# EAGLE design gripper-rev3 (EAGLE 6.5.0)
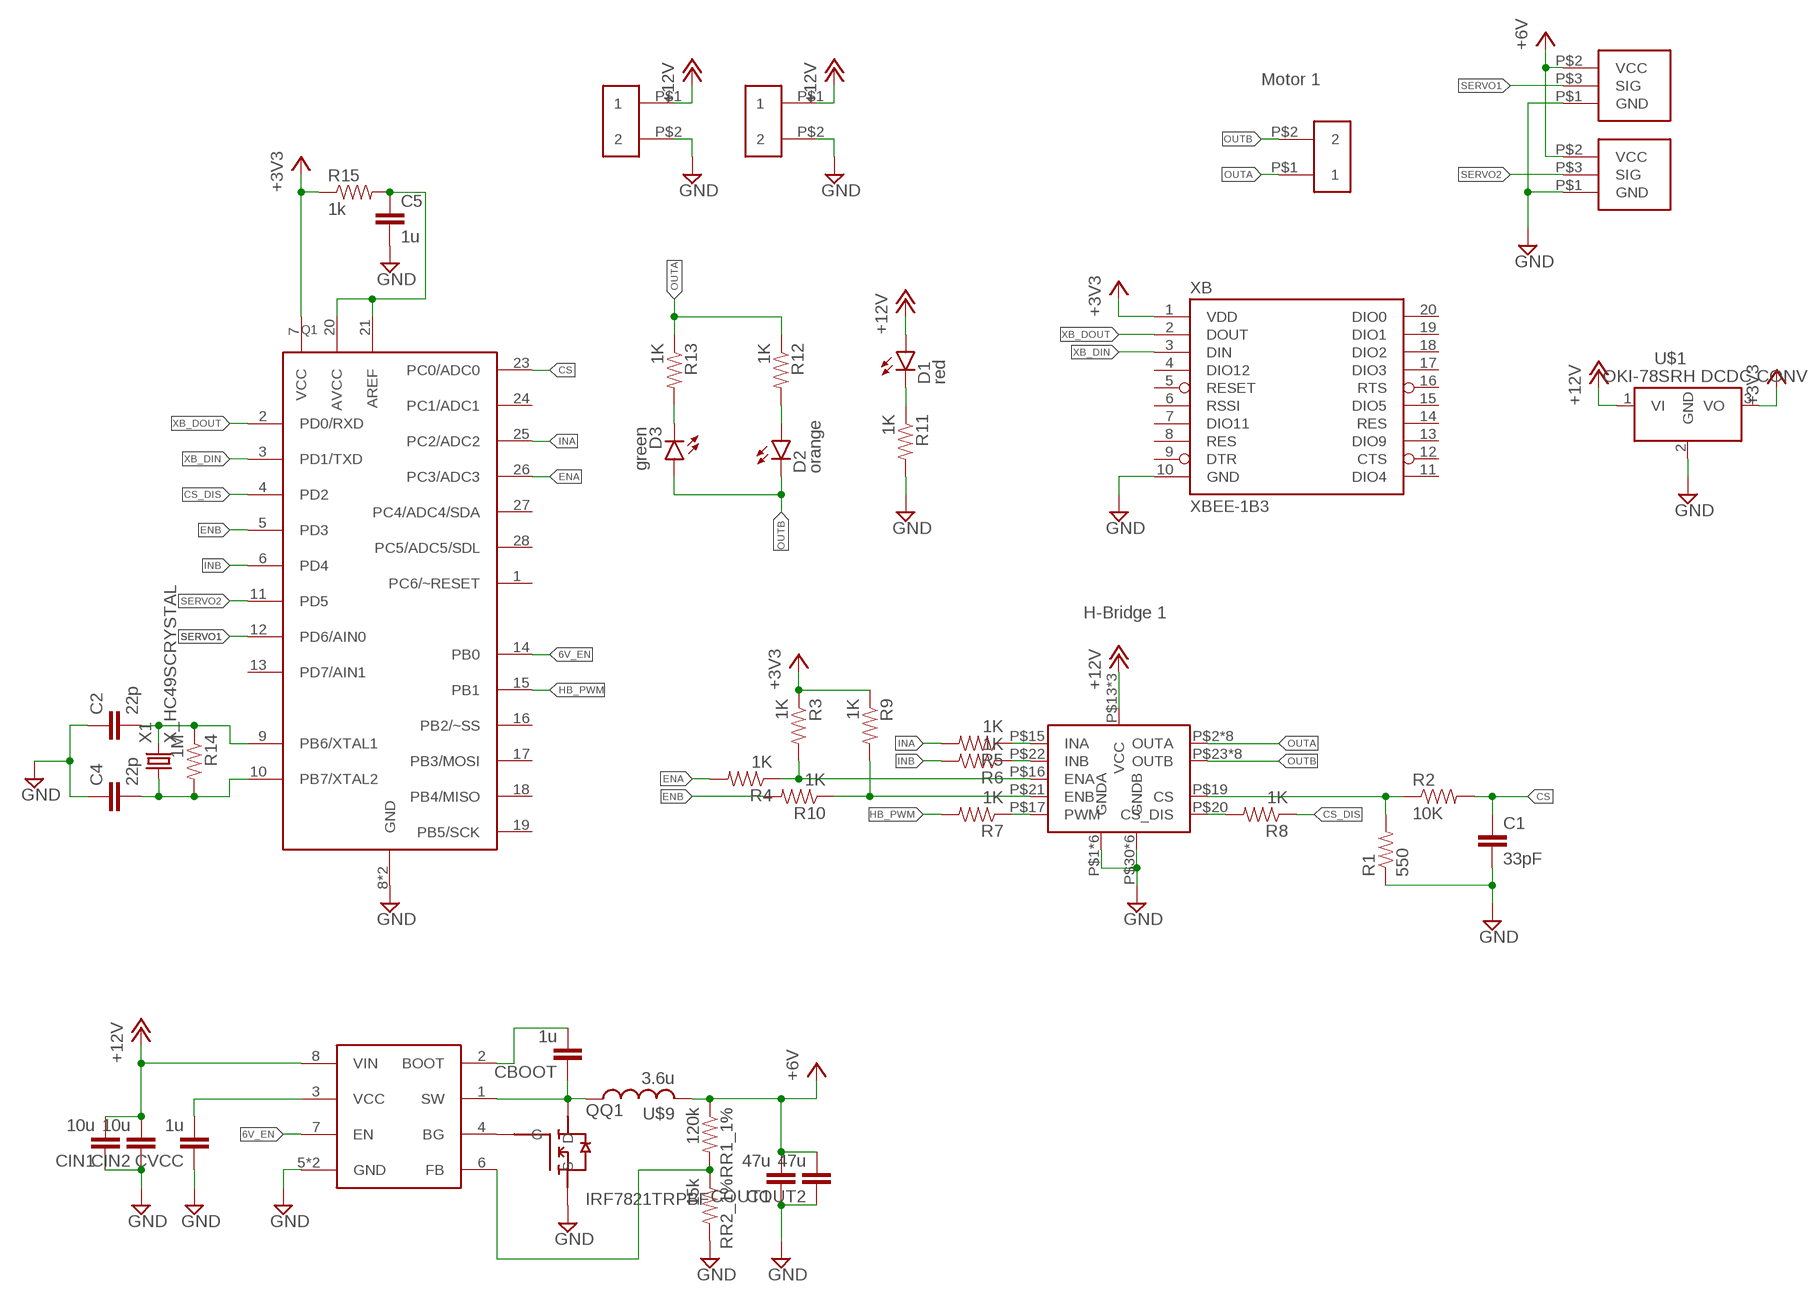
[diagram p0: schematic, sheet 1]

## Parts
C1  33pF  CAP0603-CAP  [0603-CAP]
C2  22p  CAP0603-CAP  [0603-CAP]
C4  22p  CAP0603-CAP  [0603-CAP]
C5  1u  CAP0603-CAP  [0603-CAP]
CBOOT  1u  CAP0603-CAP  [0603-CAP]
CIN1  10u  CAP1206  [1206]
CIN2  10u  CAP1206  [1206]
COUT1  47u  CAP1206  [1206]
COUT2  47u  CAP1206  [1206]
CVCC  1u  CAP0603-CAP  [0603-CAP]
D1  red  LED0603  [LED-0603]
D2  orange  LED0603  [LED-0603]
D3  green  LED0603  [LED-0603]
Q1  Q_ATMEGA328P  [DIP28]
QQ1  IRF7821TRPBF  [SO-08]
R1  550  RESISTOR0603  [0603-RES]
R2  10K  RESISTOR0603  [0603-RES]
R3  1K  RESISTOR0603  [0603-RES]
R4  1K  RESISTOR0603  [0603-RES]
R5  1K  RESISTOR0603  [0603-RES]
R6  1K  RESISTOR0603  [0603-RES]
R7  1K  RESISTOR0603  [0603-RES]
R8  1K  RESISTOR0603  [0603-RES]
R9  1K  RESISTOR0603  [0603-RES]
R10  1K  RESISTOR0603  [0603-RES]
R11  1K  RESISTOR0603  [0603-RES]
R12  1K  RESISTOR0603  [0603-RES]
R13  1K  RESISTOR0603  [0603-RES]
R14  1M  RESISTOR0603  [0603-RES]
R15  1k  RESISTOR0603  [0603-RES]
RR1_1%  120k  RESISTOR0603  [0603-RES]
RR2_1%  15k  RESISTOR0603  [0603-RES]
RT7258  RT7258GSP  [SOP08_W_EP]
U$1  Q_OKI-78SR  [OKI-78SR_HORIZ]
U$2  SERVOHORIZ  [78208-103HLF]
U$3  SERVOHORIZ  [78208-103HLF]
U$4  VNH5XXX_HBRIDGEVNH5050A  [POWERSSO-36_TP]
U$5  M02SCREWTERM_HORIZ  [PC_1935161]
U$6  M02SCREWTERM_HORIZ  [PC_1935161]
U$7  M02SCREWTERM_VERT  [PC_1935310]
U$9  3.6u  NR8040T3R6N  [NR8040T3R6N]
X1  X_HC49SCRYSTAL  [HC-49]
XB  XBEE-1B3  [XBEE-SMD]

## Nets
6V_EN: Q1.14(PB0) RT7258.7(EN)
+3V3: Q1.7(VCC) R3.1 R9.1 R15.1 U$1.3(VO) XB.1(VDD)
+6V: COUT1.2 COUT2.2 RR1_1%.1 U$2.P$2(VCC) U$3.P$2(VCC) U$9.P$2
+12V: CIN1.2 CIN2.2 D1.A RT7258.8(VIN) U$1.1(VI) U$4.P$13(VCC) U$4.P$24(VCC) U$4.SLUG1(VCC) U$5.P$1 U$6.P$1
CS: C1.1 Q1.23(PC0/ADC0) R2.2
CS_DIS: Q1.4(PD2) R8.1
ENA: Q1.26(PC3/ADC3) R4.2
ENB: Q1.5(PD3) R10.2
GND: C1.2 C2.1 C4.1 C5.2 CIN1.1 CIN2.1 COUT1.1 COUT2.1 CVCC.1 Q1.8(GND) Q1.22(GND) QQ1.1(S) QQ1.2(S) QQ1.3(S) R1.1 R11.2 RR2_1%.2 RT7258.5(GND) RT7258.EP(GND) U$1.2(GND) U$2.P$1(GND) U$3.P$1(GND) U$4.P$1(GNDA) U$4.P$3(GNDA) U$4.P$4(GNDA) U$4.P$5(GNDA) U$4.P$6(GNDA) U$4.P$7(GNDA) U$4.P$30(GNDB) U$4.P$31(GNDB) U$4.P$32(GNDB) U$4.P$33(GNDB) U$4.P$34(GNDB) U$4.P$36(GNDB) U$5.P$2 U$6.P$2 XB.10(GND)
HB_PWM: Q1.15(PB1) R7.2
INA: Q1.25(PC2/ADC2) R5.2
INB: Q1.6(PD4) R6.2
N$1: C2.2 Q1.9(PB6/XTAL1) R14.1 X1.P$2
N$2: R5.1 U$4.P$15(INA)
N$3: R1.2 R2.1 U$4.P$19(CS)
N$4: R6.1 U$4.P$22(INB)
N$5: R7.1 U$4.P$17(PWM)
N$6: R3.2 R4.1 U$4.P$16(ENA)
N$7: R9.2 R10.1 U$4.P$21(ENB)
N$8: R8.2 U$4.P$20(CS_DIS)
N$9: D1.C R11.1
N$10: C4.2 Q1.10(PB7/XTAL2) R14.2 X1.P$1
N$11: D2.A R12.2
N$12: D3.C R13.2
N$13: C5.1 Q1.20(AVCC) Q1.21(AREF) R15.2
N$14: CVCC.2 RT7258.3(VCC)
N$15: CBOOT.2 RT7258.2(BOOT)
N$16: RR1_1%.2 RR2_1%.1 RT7258.6(FB)
N$17: QQ1.4(G) RT7258.4(BG)
N$18: CBOOT.1 QQ1.5(D) QQ1.6(D) QQ1.7(D) QQ1.8(D) RT7258.1(SW) U$9.P$1
OUTA: R12.1 R13.1 U$4.P$2(OUTA) U$4.P$8(OUTA) U$4.P$9(OUTA) U$4.P$10(OUTA) U$4.P$11(OUTA) U$4.P$12(OUTA) U$4.P$14(OUTA) U$4.SLUG2(OUTA) U$7.P$1
OUTB: D2.C D3.A U$4.P$23(OUTB) U$4.P$25(OUTB) U$4.P$26(OUTB) U$4.P$27(OUTB) U$4.P$28(OUTB) U$4.P$29(OUTB) U$4.P$35(OUTB) U$4.SLUG3(OUTB) U$7.P$2
SERVO1: Q1.12(PD6/AIN0) U$2.P$3(SIG)
SERVO2: Q1.11(PD5) U$3.P$3(SIG)
XB_DIN: Q1.3(PD1/TXD) XB.3(DIN)
XB_DOUT: Q1.2(PD0/RXD) XB.2(DOUT)
Unconnected: Q1.1(PC6/~RESET) Q1.13(PD7/AIN1) Q1.16(PB2/~SS) Q1.17(PB3/MOSI) Q1.18(PB4/MISO) Q1.19(PB5/SCK) Q1.24(PC1/ADC1) Q1.27(PC4/ADC4/SDA) Q1.28(PC5/ADC5/SDL) XB.4(DIO12) XB.5(RESET) XB.6(RSSI) XB.7(DIO11) XB.8(RES) XB.9(DTR) XB.11(DIO4) XB.12(CTS) XB.13(DIO9) XB.14(RES) XB.15(DIO5) XB.16(RTS) XB.17(DIO3) XB.18(DIO2) XB.19(DIO1) XB.20(DIO0)

## Notes on the sheet
- Motor 1
- H-Bridge 1

## Library data of the parts
C1 C2 C4 C5 CBOOT CVCC = SparkFun-Passives:CAP: Capacitor Standard 0603 ceramic capacitor, and 0.1" leaded capacitor.
CIN1 CIN2 COUT1 COUT2 = SparkFun-Capacitors:CAP: Capacitor Standard 0603 ceramic capacitor, and 0.1" leaded capacitor.
D1-D3 = SparkFun-LED:LED: LEDs Standard schematic elements and footprints for 5mm, 3mm, 1206, and 0603 sized LEDs. 5mm - Spark Fun Electronics SKU : COM-00529 (and others)
Q1 = MRDT-2014-All:Q_ATMEGA328P: ATMEGA 328P in 28PIN PDIP package
QQ1 = MRDT-PowerICs:IRF7821TRPBF
R1-R15 RR1_1% RR2_1% = SparkFun-Resistors:RESISTOR: Resistor Basic schematic elements and footprints for 0603, 1206, and PTH resistors.
RT7258 = MRDT-PowerICs:RT7258GSP
U$1 = MRDT-2015-PowerBoard:Q_OKI-78SR: 4.95W DC/DC Converter Manufacturer: Murata Part Number: OKI-78SR-5/1.5-W36H-C OKI-78SR-3.3/1.5-W36H-C
U$2 U$3 = MRDT-2015-General:SERVO
U$4 = MRDT-PowerICs:VNH5XXX_HBRIDGE
U$5-U$7 = MRDT-Connectors:M02
U$9 = MRDT-Passives:NR8040T3R6N
X1 = MRDT-2014-All:X_HC49SCRYSTAL: CRYSTAL METAL CAN, 16MHZ, 18PF, HC-49/US
XB = SparkFun:XBEE-1

## Board
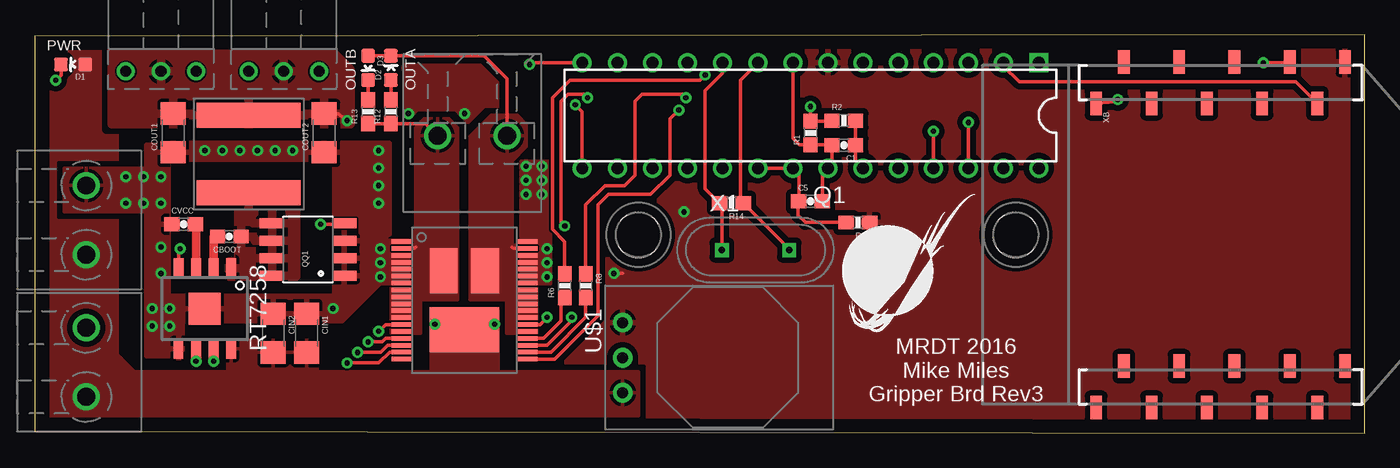
[diagram p1: board, top side]
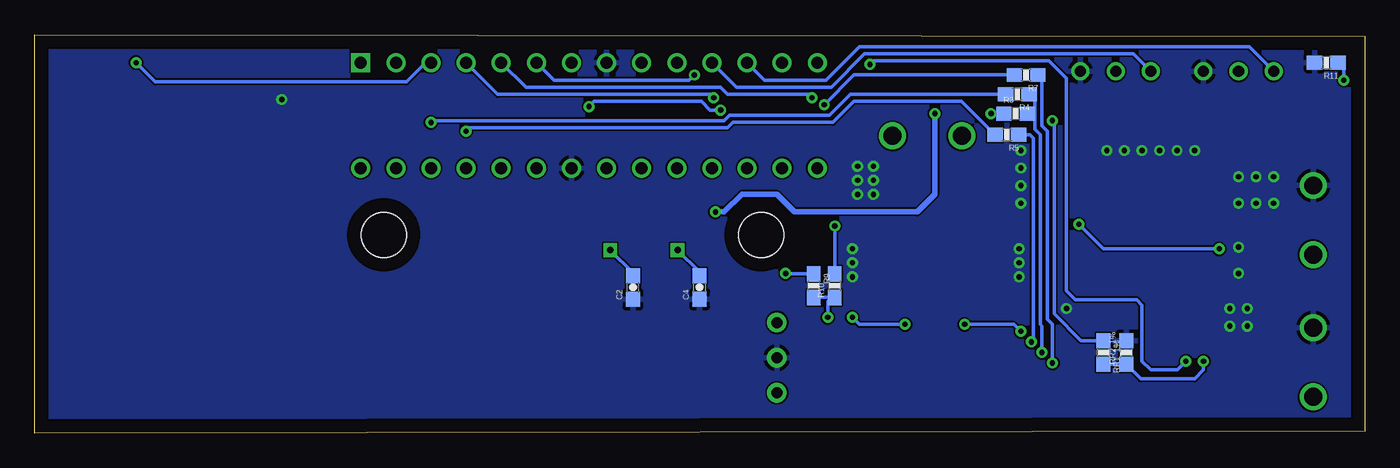
[diagram p2: board, bottom side, seen from below]

Size 96.25 x 28.83 mm. Coordinates in mm from the lower left corner, seen from the top.
Outline: 0,0.13 96.25,0 96.25,28.83 0,28.7 0,0.13
Copper layers (1*16): Top 0.035mm / dielectric 1.5mm / Bottom 0.035mm
Design rules "advanced_circuits_standard": minimum track width 5mil, minimum drill 10mil, track to track 5mil, track to pad 5mil, pad to pad 5mil, via to via 5mil, smd to smd 5mil, copper to edge 40mil, drill to drill 5mil, minimum pad ring 10mil, minimum via ring 8mil, stop-mask expansion 4mil, vias tented up to drill 0mil, thermal gap 10mil

### Footprints (pad centres in the part's own frame; a part is rotated, then mirrored left to right if it is on the bottom)
0603-CAP = smd 1.1 x 1: 1 -0.85,0; 2 0.85,0
1206 = smd 1.6 x 1.8: 1 -1.4,0; 2 1.4,0
LED-0603 = smd 1 x 1: A 0,-0.877; C 0,0.877
DIP28 = drill 0.864 square: 1 -16.51,-3.81 | drill 0.864: 2 -13.97,-3.81; 3 -11.43,-3.81; 4 -8.89,-3.81; 5 -6.35,-3.81; 6 -3.81,-3.81; 7 -1.27,-3.81; 8 1.27,-3.81; 9 3.81,-3.81; 10 6.35,-3.81; 11 8.89,-3.81; 12 11.43,-3.81; 13 13.97,-3.81; 14 16.51,-3.81; 15 16.51,3.81; 16 13.97,3.81; 17 11.43,3.81; 18 8.89,3.81; 19 6.35,3.81; 20 3.81,3.81; 21 1.27,3.81; 22 -1.27,3.81; 23 -3.81,3.81; 24 -6.35,3.81; 25 -8.89,3.81; 26 -11.43,3.81; 27 -13.97,3.81; 28 -16.51,3.81
SO-08 = smd 0.711 x 1.778: 1 0.457,-0.813; 2 1.727,-0.813; 3 2.997,-0.813; 4 4.267,-0.813; 5 4.267,4.419; 6 2.997,4.419; 7 1.727,4.419; 8 0.457,4.419
0603-RES = smd 1.1 x 1: 1 -0.85,0; 2 0.85,0
SOP08_W_EP = smd 0.711 x 1.422: 1 -1.909,-2.921; 2 -0.638,-2.921; 3 0.631,-2.921; 4 1.901,-2.921; 5 1.909,2.921; 6 0.638,2.921; 7 -0.631,2.921; 8 -1.901,2.921 | smd 2.311 x 2.311: EP 0,0
OKI-78SR_HORIZ = drill 0.8 pad 1.422: 1 0,0; 2 -2.54,0; 3 -5.08,0
78208-103HLF = drill 0.8: P$1 2.54,0; P$2 0,0; P$3 -2.54,0
POWERSSO-36_TP = smd 0.322 x 1.45: P$1 1,-0.75; P$2 1.5,-0.75; P$3 2,-0.75; P$4 2.5,-0.75; P$5 3,-0.75; P$6 3.5,-0.75; P$7 4,-0.75; P$8 4.5,-0.75; P$9 5,-0.75; P$10 5.5,-0.75; P$11 6,-0.75; P$12 6.5,-0.75; P$13 7,-0.75; P$14 7.5,-0.75; P$15 8,-0.75; P$16 8.5,-0.75; P$17 9,-0.75; P$18 9.5,-0.75; P$19 9.5,8.35; P$20 9,8.35; P$21 8.5,8.35; P$22 8,8.35; P$23 7.5,8.35; P$24 7,8.35; P$25 6.5,8.35; P$26 6,8.35; P$27 5.5,8.35; P$28 5,8.35; P$29 4.5,8.35; P$30 4,8.35; P$31 3.5,8.35; P$32 3,8.35; P$33 2.5,8.35; P$34 2,8.35; P$35 1.5,8.35; P$36 1,8.35 | smd 3.25 x 5: SLUG1 7.391,3.785 | smd 3.25 x 2: SLUG2 3.099,2.311; SLUG3 3.099,5.283
PC_1935161 = drill 1.3: P$1 2.5,4; P$2 7.5,4
PC_1935310 = drill 1.3: P$1 2.5,5.5; P$2 7.5,5.5
#4_SCREW = hole 3.264: 0,0
NR8040T3R6N = smd 1.8 x 7.5: P$1 -2.8,0; P$2 2.8,0
HC-49 = drill 0.5 square: P$1 3.235,2.325; P$2 8.115,2.325
XBEE-SMD = smd 1.7 x 0.85: 1 -12.5,20; 2 -9.5,18; 3 -12.5,16; 4 -9.5,14; 5 -12.5,12; 6 -9.5,10; 7 -12.5,8; 8 -9.5,6; 9 -12.5,4; 10 -9.5,2; 11 12.5,2; 12 9.5,4; 13 12.5,6; 14 9.5,8; 15 12.5,10; 16 9.5,12; 17 12.5,14; 18 9.5,16; 19 12.5,18; 20 9.5,20

### Placement (x,y rotation side)
C1  58.55,20.83 180 top
C2  52.96,10.54 90 bottom
C4  48.13,10.54 90 bottom
C5  56.13,16.76 0 top
CBOOT  14.1,14.22 180 top
CIN1  19.68,7.24 270 top
CIN2  17.27,7.24 270 top
COUT1  10.03,21.72 90 top
COUT2  20.95,21.72 90 top
CVCC  10.79,15.11 0 top
D1  2.79,26.67 90 top
D2  25.78,26.42 0 top
D3  24.13,26.42 180 top
Q1  56.13,22.99 180 top
QQ1  21.59,10.92 90 top
R1  56.13,21.72 90 top
R2  58.55,22.61 0 top
R3  25.27,23.11 0 bottom
R4  25.15,24.51 180 bottom
R5  25.91,21.59 180 bottom
R6  38.35,10.67 90 top
R7  24.51,25.91 180 bottom
R8  39.88,10.67 270 top
R9  39.88,10.67 270 bottom
R10  38.35,10.67 90 bottom
R11  2.79,26.8 180 bottom
R12  25.78,23.24 90 top
R13  24.13,23.24 90 top
R14  50.42,16.64 180 top
R15  59.56,15.24 180 top
RR1_1%  18.92,5.84 270 bottom
RR2_1%  17.27,5.84 90 bottom
RT7258  12.32,9.02 180 top
U$1  42.55,2.92 270 top
U$2  9.14,26.16 0 top
U$3  18.03,26.16 0 top
U$4  27.3,14.86 270 top
U$5  7.75,0.13 90 top
U$6  7.75,10.41 90 top
U$7  26.67,16 0 top
U$8  [#4_SCREW]  43.69,14.35 0 top
U$9  15.49,20.19 90 top
U$10  [#4_SCREW]  70.99,14.35 0 top
U$11  [MRDT_LOGO]  58.42,6.48 0 top
X1  46.48,10.92 0 top
XB  74.8,14.35 270 top

### Tracks (layer width: path | path; a pad name or v marks a point on that pad's centre or on a via)
6V_EN  (via drill 0.38)
  Top 0.254: RT7258.7 v12.95,5.21 | v35.81,26.67 35.94,26.8 Q1.14
  Bottom 0.254: v12.95,5.21 13.59,4.57 15.49,4.57 16.13,5.21 16.13,9.27 16.51,9.65 20.95,9.65 21.59,10.29 21.59,25.65 22.86,26.92 35.56,26.92 v35.81,26.67
+3V3  (via drill 0.38)
  Top 0.254: v41.91,11.56 42.55,11.56
  Bottom 0.254: R3.1 v27.05,23.11 | R9.1 41.87,11.52 v41.91,11.56
  Bottom 0.406: v31.11,23.11 31.11,17.27 32.38,16 41.27,16 42.55,17.27 45.09,17.27 46.35,16 v46.99,16
  pour Top (isolate 0.406, rank 6): -9.91,38.23 108.2,38.23 106.3,-7.49 -9.91,-7.49
+6V  (via drill 0.38)
  Top 0.254: v22.61,22.61 21.97,23.11 COUT2.2
  Bottom 0.254: RR1_1%.1 20.54,6.69 22.48,8.64 22.48,22.48 v22.61,22.61
  pour Top: 22.86,22.35 5.59,22.35 5.59,28.83 20.32,28.83 22.86,26.29
+12V  (via drill 0.38)
  Top 0.254: U$4.P$13 25.39,7.86 v24.89,7.37 | v28.96,7.87 29.97,7.87 30.1,7.75 | U$4.P$24 36.56,7.86 v37.08,8.38 | v33.27,7.87 32.51,7.87 32.38,7.75
  Bottom 0.254: v24.89,7.37 25.4,7.87 v28.96,7.87 | v37.08,8.38 36.58,7.87 v33.27,7.87
  pour Top: 13.97,6.73 20.45,6.73 20.45,5.21 13.97,5.21
  pour Top (isolate 0.406, rank 2, no thermals): 0.89,27.81 5.97,27.81 5.97,5.59 0.89,5.59
  pour Top (no thermals): 0.76,5.71 0.76,1.27 33.53,1.27 33.53,8.89 28.7,8.89 28.7,4.44 7.24,4.44 5.97,5.71
  pour Top: 13.97,6.73 13.97,4.44 20.45,4.44 20.45,6.73
  pour Top: 33.27,1.27 43.69,1.27 43.69,4.44 33.27,4.44
CS
  Top 0.254: Q1.23 59.4,19.72 C1.1 R2.2
CS_DIS  (via drill 0.38)
  Top 0.254: R8.1 39.88,16.51 41.27,17.91 42.67,17.91 43.43,18.67 43.43,24 43.94,24.51 46.86,24.51 v47.12,24.26
  Bottom 0.254: v47.12,24.26 47.37,24.51 62.74,24.51 Q1.4
ENA  (via drill 0.38)
  Top 0.254: v67.56,22.48 Q1.26
  Bottom 0.254: R4.2 37.21,24.51 38.73,22.99 45.97,22.99 46.35,22.61 67.44,22.61 v67.56,22.48
ENB  (via drill 0.38)
  Top 0.254: v38.35,14.99 38.1,15.24 38.1,24 38.61,24.51 39.75,24.51 v40.01,24.26
  Bottom 0.254: Q1.5 60.71,25.02 46.61,25.02 46.1,24.51 40.26,24.51 v40.01,24.26 | R10.2 v38.35,14.99
GND  (via drill 0.38)
  Top 0.254: Q1.8 54.86,21.34 55.33,20.87 R1.1 57.66,20.87 C1.2 57.7,19.47 Q1.22 56.98,18.76 C5.2 | XB.10 78.2,23.97 v78.36,24.13
  other vias: 24.89,20.45 24.89,19.18 24.89,17.91 24.89,16.64 18.67,20.45 17.4,20.45 16.13,20.45 14.86,20.45 13.59,20.45 12.32,20.45 9.78,7.75 9.78,9.02 8.51,7.75 8.51,9.02 9.14,11.56 9.14,13.46 9.14,16.64 9.14,18.54 25.02,13.34 25.02,12.32 25.02,11.3 37.08,13.34 37.08,12.32 37.08,11.3 7.87,18.54 7.87,16.64 6.6,18.54 6.6,16.64 21.59,9.02 35.56,19.3 36.7,19.3 35.56,17.27 36.7,17.27 35.56,18.29 36.7,18.29
  pour Bottom (rank 6): -4.83,34.42 102.49,34.42 102.49,-13.84 -4.83,-13.84
  pour Top: 9.4,20.95 25.65,20.95 25.65,11.56 22.23,8.13 11.43,8.13 11.43,9.91 21.72,9.91 21.72,19.81 9.4,19.81
  pour Top: 10.67,20.83 8.13,20.83 8.13,5.59 9.91,5.59 9.91,5.46 10.67,5.46 10.67,8.13 13.21,8.13 13.21,9.91 9.65,9.91 9.65,19.81 10.67,19.81
  pour Top (no thermals): 24.77,10.79 24.77,13.97 27.05,13.97 27.05,10.79
  pour Top (no thermals): 35.18,10.79 35.18,19.68 37.34,19.68 37.34,10.79
  pour Top: 2.16,19.18 2.16,16 8.51,16 8.51,19.18
HB_PWM  (via drill 0.38)
  Top 0.254: v39.12,23.75 39.62,23.24 Q1.15
  Bottom 0.254: R7.2 36.96,25.91 v39.12,23.75
INA  (via drill 0.38)
  Top 0.254: v65.02,21.84 Q1.25
  Bottom 0.254: v65.02,21.84 64.77,22.1 46.1,22.1 45.72,22.48 38.48,22.48 36.96,24 29.21,24 26.89,21.68 26.85,21.68 R5.2
INB  (via drill 0.38)
  Top 0.254: v48.51,25.91 48.13,25.53 38.73,25.53 37.47,24.26 37.47,14.73 38.35,13.84 R6.2
  Bottom 0.254: v48.51,25.91 48.9,25.53 58.67,25.53 Q1.6
N$1
  Top 0.254: Q1.9 51.05,25.53 51.05,16.85 R14.1 54.6,13.31 X1.P$2
  Bottom 0.254: C2.2 52.96,11.61 X1.P$2
N$2  (via drill 0.38)
  Top 0.254: U$4.P$15 25.4,6.86 25.15,6.6 v24.13,6.6
  Bottom 0.254: v24.13,6.6 24,6.73 24,21.34 24.26,21.59 R5.1
N$3  (via drill 0.38)
  Top 0.254: U$4.P$19 37.62,5.36 40.77,8.51 40.77,16.51 41.53,17.27 44.58,17.27 45.97,18.67 45.97,22.73 v46.61,23.37 | R2.1 57.48,22.57 R1.2 v56.13,23.62
  Bottom 0.254: v46.61,23.37 47.37,23.37 48.01,24 55.75,24 v56.13,23.62
N$4
  Top 0.254: U$4.P$22 36.83,6.86 38.1,8.13 38.1,9.44 R6.1
N$5  (via drill 0.38)
  Top 0.254: U$4.P$17 25.67,5.86 24.89,5.08 v22.61,5.08
  Bottom 0.254: v22.61,5.08 22.61,7.87 22.99,8.26 22.99,21.84 23.37,22.22 23.37,25.61 R7.1
N$6  (via drill 0.38)
  Top 0.254: U$4.P$16 25.54,6.36 25.02,5.84 v23.37,5.84
  Bottom 0.254: v23.37,5.84 23.37,7.75 23.5,7.87 23.5,21.59 23.88,21.97 23.88,23.11 | 23.88,23.11 23.88,24.47 R4.1 | R3.2 23.88,23.11
N$7  (via drill 0.38)
  Top 0.254: U$4.P$21 37.09,6.36 38.86,8.13 v38.86,8.38
  Bottom 0.254: v38.86,8.38 38.86,9.53 38.82,9.56 38.73,9.56 R10.1 R9.2
N$8
  Top 0.254: U$4.P$20 37.35,5.86 39.88,8.38 R8.2
N$9  (via drill 0.38)
  Top 0.254: D1.C 1.92,25.9 v1.52,25.53
  Bottom 0.254: v1.52,25.53 1.52,26.38 R11.1
N$10
  Top 0.254: Q1.10 49.78,26.04 48.51,24.77 48.51,17.69 R14.2 49.72,16.49 X1.P$1
  Bottom 0.254: C4.2 48.13,11.66 X1.P$1
N$11
  Top 0.254: D2.A R12.2
N$12
  Top 0.254: D3.C R13.2
N$13
  Top 0.254: Q1.20 Q1.21 55.28,18.76 C5.1 55.24,16.85 55.24,15.75 55.75,15.24 R15.2
N$14
  Top 0.61: RT7258.3 11.69,15.11 CVCC.2
N$15
  Top 0.61: RT7258.2 12.96,14.22 CBOOT.2
N$16  (via drill 0.38)
  Top 0.254: RT7258.6 v11.68,5.21
  Bottom 0.254: RR1_1%.2 RR2_1%.1 16.22,3.94 12.32,3.94 11.68,4.57 v11.68,5.21
N$17  (via drill 0.38)
  Top 0.254: RT7258.4 10.42,13.21 v10.54,13.34 | v20.7,15.11 22.33,15.11 QQ1.4
  Bottom 0.254: v10.54,13.34 18.92,13.34 v20.7,15.11
N$18
  pour Top: 18.92,17.91 12.06,17.91 12.06,16.76 14.73,16.76 14.73,12.45 14.1,12.45 14.1,11.3 18.92,11.3
OUTA
  Top 0.254: U$4.P$2 27.46,13.36 27.56,13.46 | R13.1 R12.1 28.28,22.39 U$7.P$1
  pour Top (rank 2, no thermals): 25.78,7.24 27.94,7.24 27.94,9.65 30.61,9.65 30.61,13.59 25.78,13.59
  pour Top: 27.56,13.46 27.56,22.1 28.19,22.73 29.97,22.73 30.61,22.1 30.61,13.59 30.61,13.46
OUTB
  Top 0.254: U$4.P$35 34.65,13.36 34.54,13.46 | D3.A D2.C 32.52,27.29 34.17,25.65 U$7.P$2
  pour Top (rank 2, no thermals): 36.32,7.24 34.16,7.24 34.16,9.65 31.5,9.65 31.5,13.59 36.32,13.59
  pour Top: 31.5,13.34 31.5,21.46 33.02,22.99 34.92,22.99 35.56,22.35 35.56,20.7 34.54,19.68 34.54,13.34
SERVO1
  Bottom 0.254: U$2.P$3 8.38,27.94 36.58,27.94 38.99,25.53 43.43,25.53 Q1.12
SERVO2
  Bottom 0.254: U$3.P$3 16.76,27.43 36.2,27.43 38.61,25.02 45.47,25.02 Q1.11
XB_DIN  (via drill 0.38)
  Top 0.254: 90.81,26.98 XB.3 90.62,26.8 v88.9,26.8
  Bottom 0.254: Q1.3 67.94,26.8 69.34,25.4 87.5,25.4 v88.9,26.8
XB_DOUT
  Top 0.254: Q1.2 70.1,26.54 71.25,25.4 91.25,25.4 XB.2

### Text on the board
tPlace: PWR | OUTB | OUTA | MRDT 2016 / Mike Miles / Gripper Brd Rev3